# EAGLE schematic Aerobal PCB - t1 (EAGLE 6.5.0)
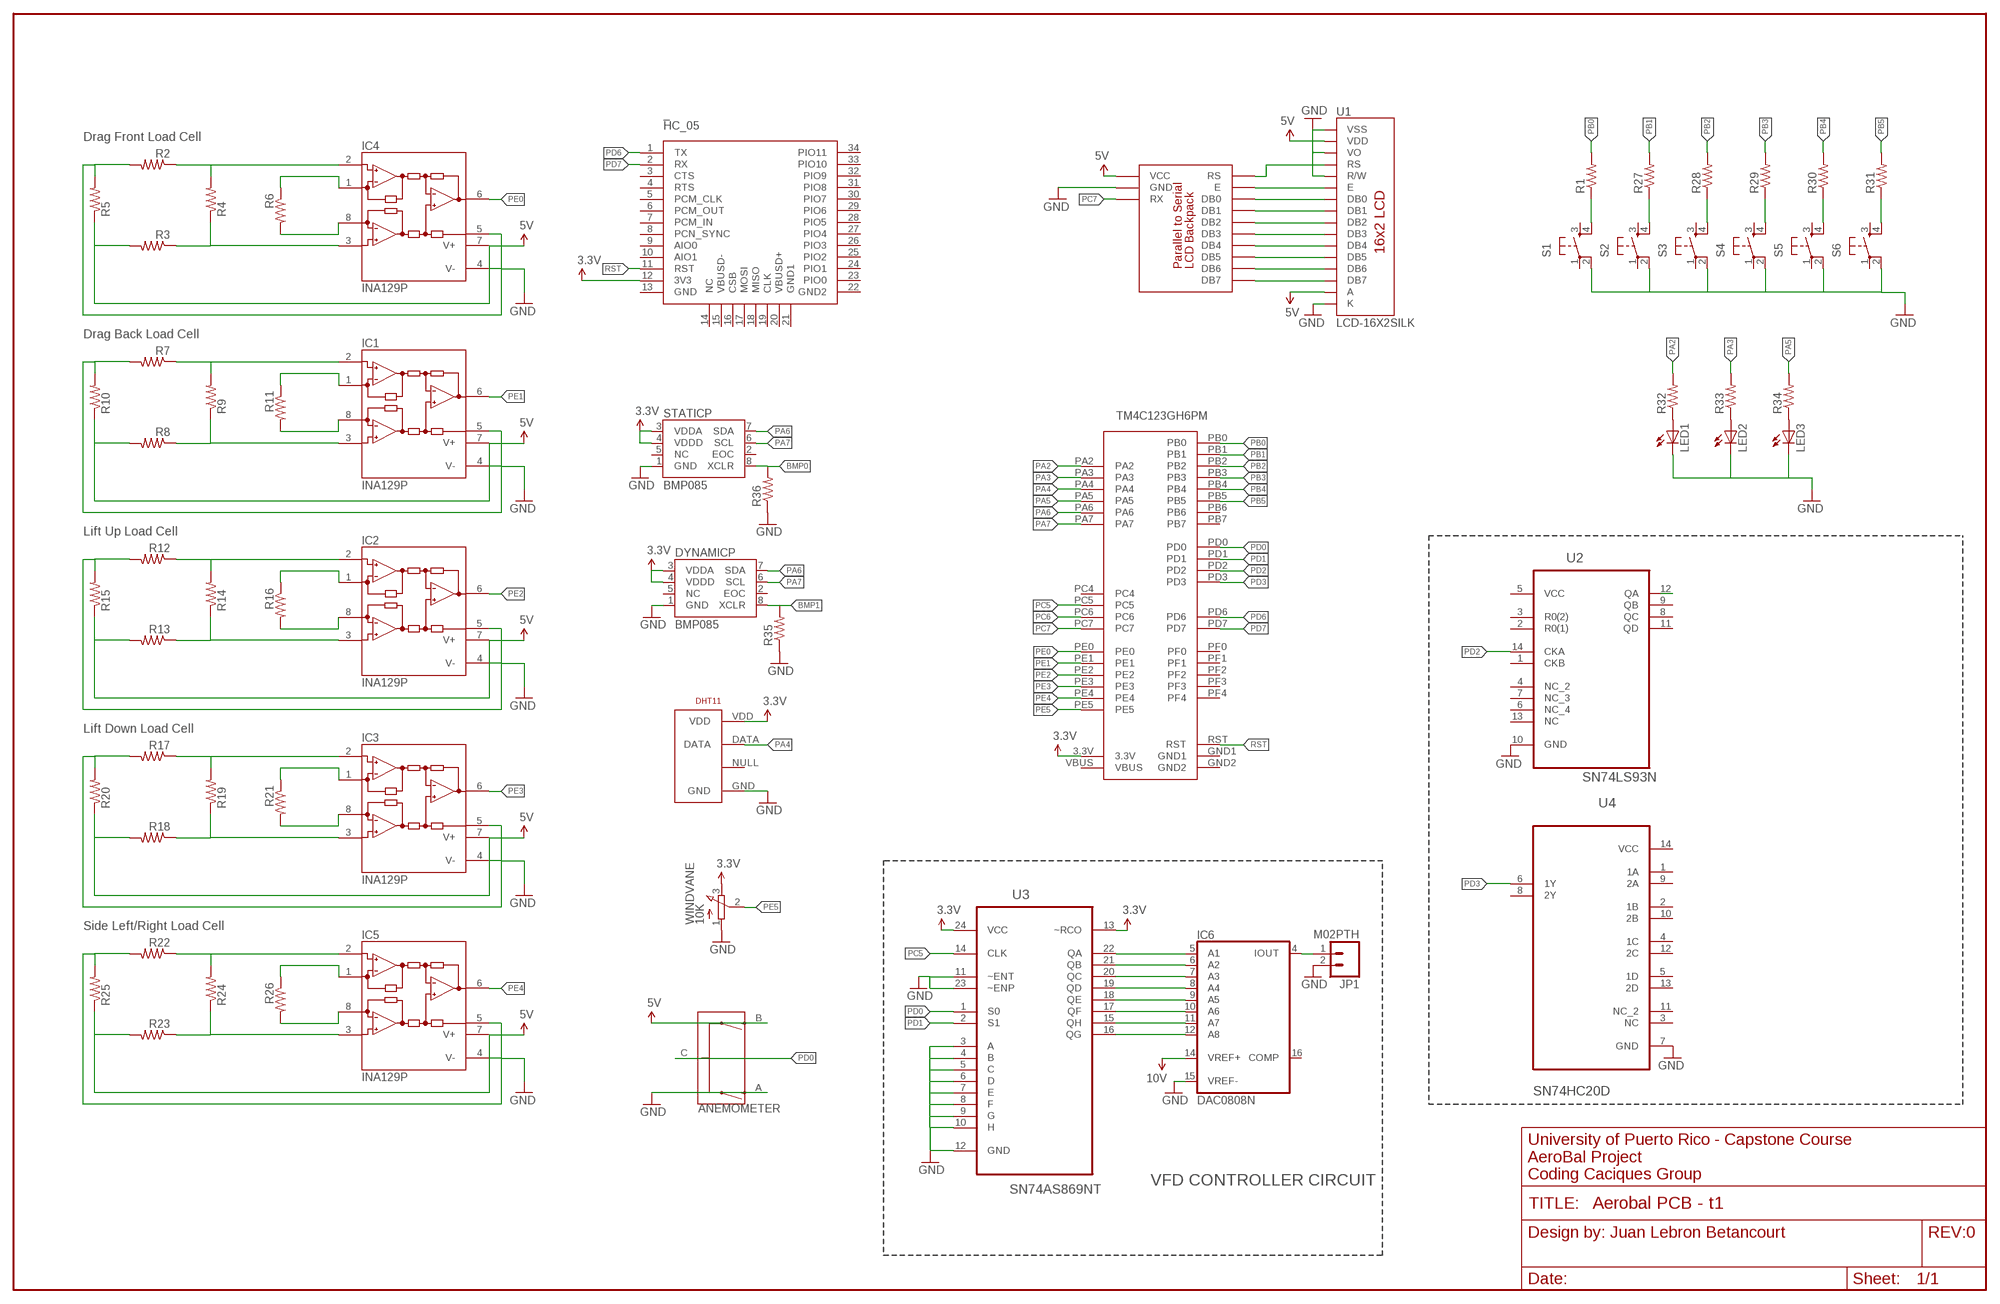
[diagram p0: schematic, sheet 1]

## Parts
_  HC_05  [BLUETOOTH_SMD]
ANEMOMETER  ENCODER-QUADRATURE  [ENCODER-16MM-QUAD]
DHT11  RHT03_DHT-22_AM2302  [RHT03_DHT-22]
DYNAMICP  BMP085  [BMP085]
FRAME1  FRAME-LEDGER  [CREATIVE_COMMONS]
IC1  INA129P  [DIL08]
IC2  INA129P  [DIL08]
IC3  INA129P  [DIL08]
IC4  INA129P  [DIL08]
IC5  INA129P  [DIL08]
IC6  DAC0808N  [DIL16]
JP1  M02PTH  [1X02]
LED1  LED5MM  [LED5MM]
LED2  LED5MM  [LED5MM]
LED3  LED5MM  [LED5MM]
R1  RESISTORPTH-1/4W  [AXIAL-0.4]
R2  RESISTORPTH-1/4W  [AXIAL-0.4]
R3  RESISTORPTH-1/4W  [AXIAL-0.4]
R4  RESISTORPTH-1/4W  [AXIAL-0.4]
R5  RESISTORPTH-1/4W  [AXIAL-0.4]
R6  RESISTORPTH-1/4W  [AXIAL-0.4]
R7  RESISTORPTH-1/4W  [AXIAL-0.4]
R8  RESISTORPTH-1/4W  [AXIAL-0.4]
R9  RESISTORPTH-1/4W  [AXIAL-0.4]
R10  RESISTORPTH-1/4W  [AXIAL-0.4]
R11  RESISTORPTH-1/4W  [AXIAL-0.4]
R12  RESISTORPTH-1/4W  [AXIAL-0.4]
R13  RESISTORPTH-1/4W  [AXIAL-0.4]
R14  RESISTORPTH-1/4W  [AXIAL-0.4]
R15  RESISTORPTH-1/4W  [AXIAL-0.4]
R16  RESISTORPTH-1/4W  [AXIAL-0.4]
R17  RESISTORPTH-1/4W  [AXIAL-0.4]
R18  RESISTORPTH-1/4W  [AXIAL-0.4]
R19  RESISTORPTH-1/4W  [AXIAL-0.4]
R20  RESISTORPTH-1/4W  [AXIAL-0.4]
R21  RESISTORPTH-1/4W  [AXIAL-0.4]
R22  RESISTORPTH-1/4W  [AXIAL-0.4]
R23  RESISTORPTH-1/4W  [AXIAL-0.4]
R24  RESISTORPTH-1/4W  [AXIAL-0.4]
R25  RESISTORPTH-1/4W  [AXIAL-0.4]
R26  RESISTORPTH-1/4W  [AXIAL-0.4]
R27  RESISTORPTH-1/4W  [AXIAL-0.4]
R28  RESISTORPTH-1/4W  [AXIAL-0.4]
R29  RESISTORPTH-1/4W  [AXIAL-0.4]
R30  RESISTORPTH-1/4W  [AXIAL-0.4]
R31  RESISTORPTH-1/4W  [AXIAL-0.4]
R32  RESISTORPTH-1/4W  [AXIAL-0.4]
R33  RESISTORPTH-1/4W  [AXIAL-0.4]
R34  RESISTORPTH-1/4W  [AXIAL-0.4]
R35  RESISTORPTH-1/4W  [AXIAL-0.4]
R36  RESISTORPTH-1/4W  [AXIAL-0.4]
S1  TAC_SWITCHPTH  [TACTILE-PTH]
S2  TAC_SWITCHPTH  [TACTILE-PTH]
S3  TAC_SWITCHPTH  [TACTILE-PTH]
S4  TAC_SWITCHPTH  [TACTILE-PTH]
S5  TAC_SWITCHPTH  [TACTILE-PTH]
S6  TAC_SWITCHPTH  [TACTILE-PTH]
STATICP  BMP085  [BMP085]
TM4C123GH6PM  STELLARIS-LAUNCHPADSTELLARIS-LAUNCHPAD-XL  [LAUNCHPAD-XL]
U1  LCD-16X2SILK  [LCD-16X2]
U2  SN74LS93N  [DIP254P762X508-14]
U3  SN74AS869NT  [DIP254P762X508-24]
U4  SN74HC20D  [SOIC127P600X175-14N]
U$1  LCDBACKPACKLCD_BACKPACK  [BACKPACK]
WINDVANE  10K  3RP/1610N  [3RP/1610N]

## Nets
3.3V: _.12(3V3) DHT11.VDD DYNAMICP.3(VDDA) DYNAMICP.4(VDDD) IC6.14(VREF+) STATICP.3(VDDA) STATICP.4(VDDD) TM4C123GH6PM.3.3V U3.13(~RCO) U3.24(VCC) WINDVANE.3(E) ; supply symbol labelled 10V
5V: ANEMOMETER.B IC1.7(V+) IC2.7(V+) IC3.7(V+) IC4.7(V+) IC5.7(V+) R3.P$2 R5.P$1 R8.P$2 R10.P$1 R13.P$2 R15.P$1 R18.P$2 R20.P$1 R23.P$2 R25.P$1 U1.2(VDD) U1.15(A) U$1.P$13(VCC)
BMP0: R36.P$2 STATICP.8(XCLR)
BMP1: DYNAMICP.8(XCLR) R35.P$2
GND: ANEMOMETER.A DHT11.GND DYNAMICP.1(GND) IC1.4(V-) IC1.5(REF) IC2.4(V-) IC2.5(REF) IC3.4(V-) IC3.5(REF) IC4.4(V-) IC4.5(REF) IC5.4(V-) IC5.5(REF) IC6.15(VREF-) JP1.2 LED1.K(C) LED2.K(C) LED3.K(C) R2.P$2 R5.P$2 R7.P$2 R10.P$2 R12.P$2 R15.P$2 R17.P$2 R20.P$2 R22.P$2 R25.P$2 R35.P$1 R36.P$1 S6.2 STATICP.1(GND) U1.3(VO) U1.5(R/W) U1.16(K) U2.10(GND) U3.3(A) U3.4(B) U3.5(C) U3.6(D) U3.7(E) U3.8(F) U3.9(G) U3.10(H) U3.11(~ENT) U3.12(GND) U3.23(~ENP) U4.7(GND) U$1.P$10(GND) WINDVANE.1(A)
N$1: R3.P$1 R4.P$1
N$2: R1.P$1 S1.4
N$3: IC1.3(+IN)
N$4: R8.P$1 R9.P$1
N$5: IC4.3(+IN)
N$6: IC4.8(RG) R6.P$2
N$7: IC4.1(RG) R6.P$1
N$8: IC4.2(-IN) R2.P$1 R4.P$2
N$9: R27.P$1 S2.4
N$10: IC1.8(RG) R11.P$2
N$11: IC1.1(RG) R11.P$1
N$12: IC1.2(-IN) R7.P$1 R9.P$2
N$13: IC2.3(+IN)
N$14: R13.P$1 R14.P$1
N$15: U1.14(DB7) U$1.P$8(DB7)
N$16: IC2.8(RG) R16.P$2
N$17: IC2.1(RG) R16.P$1
N$18: IC2.2(-IN) R12.P$1 R14.P$2
N$19: IC3.3(+IN)
N$20: R18.P$1 R19.P$1
N$21: U1.13(DB6) U$1.P$7(DB6)
N$22: IC3.8(RG) R21.P$2
N$23: IC3.1(RG) R21.P$1
N$24: IC3.2(-IN) R17.P$1 R19.P$2
N$25: IC5.3(+IN)
N$26: R23.P$1 R24.P$1
N$27: U1.12(DB5) U$1.P$6(DB5)
N$28: IC5.8(RG) R26.P$2
N$29: IC5.1(RG) R26.P$1
N$30: IC5.2(-IN) R22.P$1 R24.P$2
N$31: U1.11(DB4) U$1.P$5(DB4)
N$32: U1.10(DB3) U$1.P$4(DB3)
N$33: U1.9(DB2) U$1.P$3(DB2)
N$34: U1.8(DB1) U$1.P$2(DB1)
N$35: U1.7(DB0) U$1.P$1(DB0)
N$36: U1.6(E) U$1.P$9(E)
N$37: U1.4(RS) U$1.P$11(RS)
N$38: U1.1(VSS)
N$39: R28.P$1 S3.4
N$40: R29.P$1 S4.4
N$41: R30.P$1 S5.4
N$42: R31.P$1 S6.4
N$43: S1.2
N$44: S2.2
N$45: S3.2
N$46: S4.2
N$47: S5.2
N$48: LED1.A R32.P$1
N$49: LED2.A R33.P$1
N$50: LED3.A R34.P$1
N$51: U2.12(QA)
N$55: IC6.5(A1) U3.22(QA)
N$56: IC6.6(A2) U3.21(QB)
N$57: IC6.7(A3) U3.20(QC)
N$58: IC6.8(A4) U3.19(QD)
N$59: IC6.9(A5) U3.18(QE)
N$60: IC6.10(A6) U3.17(QF)
N$61: IC6.11(A7) U3.15(QH)
N$62: IC6.12(A8) U3.16(QG)
N$63: IC6.4(IOUT) JP1.1
PA2: R32.P$2 TM4C123GH6PM.PA2
PA3: R33.P$2 TM4C123GH6PM.PA3
PA4: DHT11.DATA TM4C123GH6PM.PA4
PA5: R34.P$2 TM4C123GH6PM.PA5
PA6: DYNAMICP.7(SDA) STATICP.7(SDA) TM4C123GH6PM.PA6
PA7: DYNAMICP.6(SCL) STATICP.6(SCL) TM4C123GH6PM.PA7
PB0: R1.P$2 TM4C123GH6PM.PB0
PB1: R27.P$2 TM4C123GH6PM.PB1
PB2: R28.P$2 TM4C123GH6PM.PB2
PB3: R29.P$2 TM4C123GH6PM.PB3
PB4: R30.P$2 TM4C123GH6PM.PB4
PB5: R31.P$2 TM4C123GH6PM.PB5
PC5: TM4C123GH6PM.PC5 U3.14(CLK)
PC6: TM4C123GH6PM.PC6
PC7: TM4C123GH6PM.PC7 U$1.P$12(RX)
PD0: ANEMOMETER.C TM4C123GH6PM.PD0 U3.1(S0)
PD1: TM4C123GH6PM.PD1 U3.2(S1)
PD2: TM4C123GH6PM.PD2 U2.14(CKA)
PD3: TM4C123GH6PM.PD3 U4.6(1Y)
PD6: _.1(TX) TM4C123GH6PM.PD6
PD7: _.2(RX) TM4C123GH6PM.PD7
PE0: IC4.6(OUT) TM4C123GH6PM.PE0
PE1: IC1.6(OUT) TM4C123GH6PM.PE1
PE2: IC2.6(OUT) TM4C123GH6PM.PE2
PE3: IC3.6(OUT) TM4C123GH6PM.PE3
PE4: IC5.6(OUT) TM4C123GH6PM.PE4
PE5: TM4C123GH6PM.PE5 WINDVANE.2(S)
RST: _.11(RST) TM4C123GH6PM.RST
Unconnected: _.3(CTS) _.4(RTS) _.5(PCM_CLK) _.6(PCM_OUT) _.7(PCM_IN) _.8(PCN_SYNC) _.9(AIO0) _.10(AIO1) _.13(GND) _.14(NC) _.15(VBUSD-) _.16(CSB) _.17(MOSI) _.18(MISO) _.19(CLK) _.20(VBUSD+) _.21(GND1) _.22(GND2) _.23(PIO0) _.24(PIO1) _.25(PIO2) _.26(PIO3) _.27(PIO4) _.28(PIO5) _.29(PIO6) _.30(PIO7) _.31(PIO8) _.32(PIO9) _.33(PIO10) _.34(PIO11) DHT11.NULL DYNAMICP.2(EOC) DYNAMICP.5(NC) IC6.16(COMP) S1.1 S1.3 S2.1 S2.3 S3.1 S3.3 S4.1 S4.3 S5.1 S5.3 S6.1 S6.3 STATICP.2(EOC) STATICP.5(NC) TM4C123GH6PM.GND1 TM4C123GH6PM.PB6 TM4C123GH6PM.PB7 TM4C123GH6PM.PC4 TM4C123GH6PM.PF0 TM4C123GH6PM.PF1 TM4C123GH6PM.PF2 TM4C123GH6PM.PF3 TM4C123GH6PM.PF4 U2.1(CKB) U2.2(R0(1)) U2.3(R0(2)) U2.4(NC_2) U2.6(NC_4) U2.7(NC_3) U2.8(QC) U2.9(QB) U2.11(QD) U2.13(NC) U4.1(1A) U4.2(1B) U4.3(NC) U4.4(1C) U4.5(1D) U4.8(2Y) U4.9(2A) U4.10(2B) U4.11(NC_2) U4.12(2C) U4.13(2D)

## Notes on the sheet
- Drag Front Load Cell
- Drag Back Load Cell
- Lift Up Load Cell
- Lift Down Load Cell
- Side Left/Right Load Cell
- VFD CONTROLLER CIRCUIT

## Power pins joined to a net without a drawn wire
GND: IC6.2(GND)
GND2: TM4C123GH6PM.GND2
VBUS: TM4C123GH6PM.VBUS
VCC: IC6.13(VCC) U2.5(VCC) U4.14(VCC)
VEE: IC6.3(VEE)

## Library data of the parts
_ = SerialPortBluetooth:HC_05
ANEMOMETER = SparkFun-Electromechanical:ENCODER-QUADRATURE: quadrature encoder from Top-Up, part#EC16PHBF-B-20F-24-24C-16Y
DHT11 = RHT03_DHT-22_AM2302:RHT03_DHT-22_AM2302: RHT03 / DHT-22 / AM2302 Packages and symbol for the RHT03 / DHT-22 relative humidity and temperature sensor. Note: The AM2302 is a wired version of the DHT-22 which typically requires less clearance and is thus provided as a separate package.; PROD_ID: SEN-10167
DYNAMICP STATICP = SparkFun-Sensors:BMP085: BMP085 Pressure Sensor Great little MEMS pressure sensor. SKU: COM-09603
FRAME1 = SparkFun-Aesthetics:FRAME-LEDGER: Schematic Frame Standard 11x14 US Ledger frame
IC1-IC5 = burr-brown:INA129: Instrumentation Amplifiers Precision, Low Power; MF: TEXAS INSTRUMENTS; MPN: INA129P; OC_FARNELL: 1212414; OC_NEWARK: 74C9786
IC6 = linear:DAC0808: 8-bit DIGITAL/ANALOG CONVERTER Source: http://www.national.com/ds/DA/DAC0808.pdf
JP1 = SparkFun-Connectors:M02: Standard 2-pin 0.1" header. Use with - straight break away headers ( PRT-00116) - right angle break away headers (PRT-00553) - swiss pins (PRT-00743) - machine pins (PRT-00117) - female headers (PRT-00115) Molex polarized connector foot print use with: PRT-08233 with associated crimp pins and housings. 2.54_SCREWTERM for use with PRT-10571. 3.5mm Screw Terminal footprints for PRT-08084 5mm Screw Terminal footprints for use with PRT-08433
LED1-LED3 = led:LED: LED OSRAM: - CHIPLED LG R971, LG N971, LY N971, LG Q971, LY Q971, LO R971, LY R971 LH N974, LH R974 LS Q976, LO Q976, LY Q976 LO Q996 - Hyper CHIPLED LW Q18S LB Q993, LB Q99A, LB R99A - SideLED LS A670, LO A670, LY A670, LG A670, LP A670 LB A673, LV A673, LT A673, LW A673 LH A674 LY A675 LS A676, LA A676, LO A676, LY A676, LW A676 LS A679, LY A679, LG A679 - Hyper Micro SIDELED® LS Y876, LA Y876, LO Y876, LY Y876 LT Y87S - SmartLED LW L88C, LW L88S LB L89C, LB L89S, LG L890 LS L89K, LO L89K, LY L89K LS L896, LA L896, LO L896, LY L896 - TOPLED LS T670, LO T670, LY T670, LG T670, LP T670 LSG T670, LSP T670, LSY T670, LOP T670, LYG T670 LG T671, LOG T671, LSG T671 LB T673, LV T673, LT T673, LW T673 LH T674 LS T676, LA T676, LO T676, LY T676, LB T676, LH T676, LSB T676, LW T676 LB T67C, LV T67C, LT T67C, LS T67K, LO T67K, LY T67K, LW E67C LS E67B, LA E67B, LO E67B, LY E67B, LB E67C, LV E67C, LT E67C LW T67C LS T679, LY T679, LG T679 LS T770, LO T770, LY T770, LG T770, LP T770 LB T773, LV T773, LT T773, LW T773 LH T774 LS E675, LA E675, LY E675, LS T675 LS T776, LA T776, LO T776, LY T776, LB T776 LHGB T686 LT T68C, LB T68C - Hyper Mini TOPLED® LB M676 - Mini TOPLED Santana® LG M470 LS M47K, LO M47K, LY M47K Source: http://www.osram.convergy.de LUXEON: - LUMILED® LXK2-PW12-R00, LXK2-PW12-S00, LXK2-PW14-U00, LXK2-PW14-V00 LXK2-PM12-R00, LXK2-PM12-S00, LXK2-PM14-U00 LXK2-PE12-Q00, LXK2-PE12-R00, LXK2-PE12-S00, LXK2-PE14-T00, LXK2-PE14-U00 LXK2-PB12-K00, LXK2-PB12-L00, LXK2-PB12-M00, LXK2-PB14-N00, LXK2-PB14-P00, LXK2-PB14-Q00 LXK2-PR12-L00, LXK2-PR12-M00, LXK2-PR14-Q00, LXK2-PR14-R00 LXK2-PD12-Q00, LXK2-PD12-R00, LXK2-PD12-S00 LXK2-PH12-R00, LXK2-PH12-S00 LXK2-PL12-P00, LXK2-PL12-Q00, LXK2-PL12-R00 Source: www.luxeon.com KINGBRIGHT: KA-3528ASYC Source: www.kingbright.com
R1-R36 = SparkFun-Resistors:RESISTOR: Resistor Basic schematic elements and footprints for 0603, 1206, and PTH resistors.
S1-S6 = SparkFun-Electromechanical:TAC_SWITCH: Momentary Switch Button commonly used for reset or general input. Spark Fun Electronics SKU : COM-00097 SMT- SWCH-08247
TM4C123GH6PM = StellarisLaunchPad:STELLARIS-LAUNCHPAD
U1 = SparkFun-Displays:LCD-16X2: Standard text-only 16x2 parallel input LCD
U2 = Texas Instruments_By_element14_Batch_1:SN74LS93N: DECADE, DIVIDE-BY-TWELVE AND BINARY COUNTERS; MPN: SN74LS93N; OC_FARNELL: 1470792; OC_NEWARK: 60K6898; PACKAGE: DIP-14; SUPPLIER: Texas Instruments
U3 = Texas Instruments_By_element14_Batch_1:SN74AS869NT: 8-BIT SYNC UP/DOWN COUNTER; MPN: SN74AS869NT; OC_FARNELL: -; OC_NEWARK: 67K1061; PACKAGE: DIP-24; SUPPLIER: TEXAS INSTRUMENTS
U4 = Texas Instruments_By_element14_Batch_1:SN74HC20D: Dual 4 Input Positive AND Gate; MPN: SN74HC20D; OC_FARNELL: 1470872; OC_NEWARK: 70C4339; PACKAGE: SOIC-14; SUPPLIER: Texas Instruments
U$1 = LCD Backpack:LCDBACKPACK
WINDVANE = pot:3RP/1610N: 16mm Potentiometer one level Source: http://www.alphapotentiometers.net/html/16mm_pot_2.html